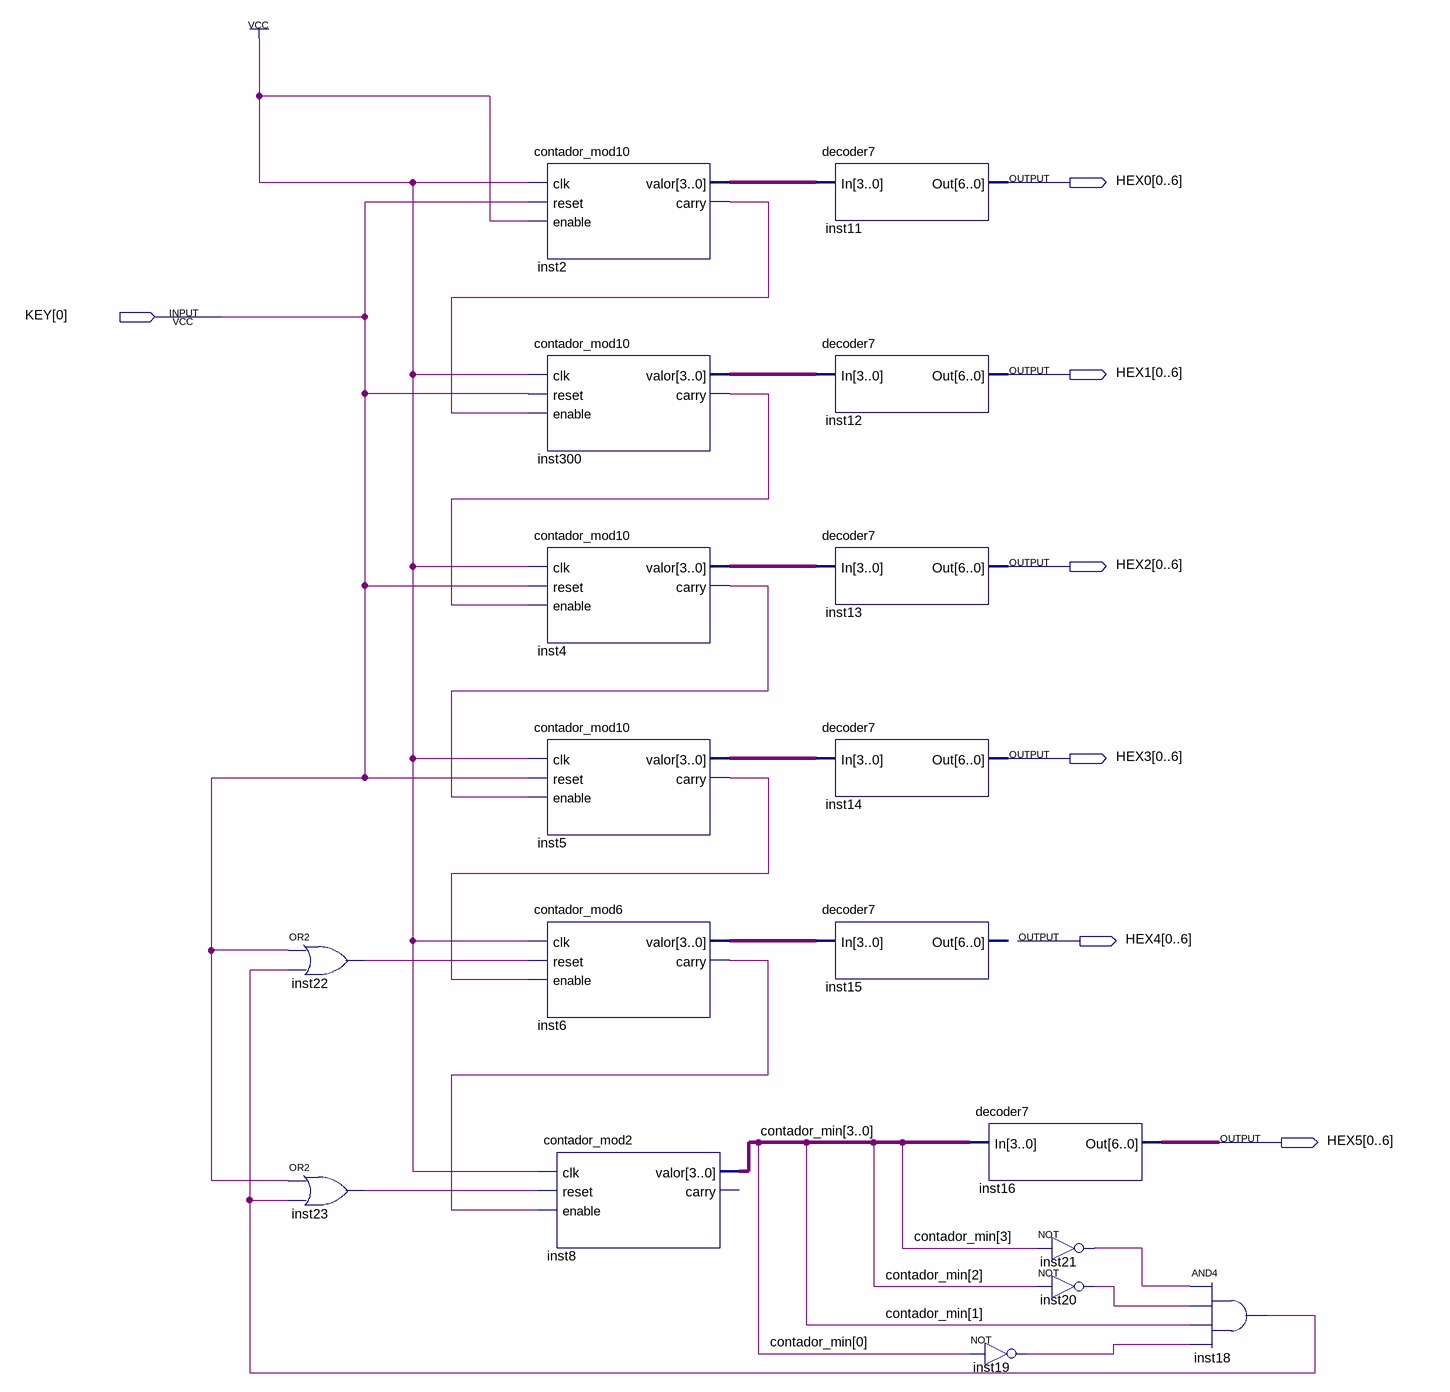
[diagram p0: schematic sheet]
// Quartus schematic cronometro_enable_sim.bdf as structural Verilog: 18 symbols, 7 pins
module cronometro_enable_sim (
  input  [0:0] KEY,
  output [0:6] HEX0,
  output [0:6] HEX1,
  output [0:6] HEX2,
  output [0:6] HEX3,
  output [0:6] HEX4,
  output [0:6] HEX5
);

  wire inst2_carry, inst4_carry, inst5_carry, inst6_carry, inst18_out, inst19_out, inst20_out, inst21_out,
       inst22_out, inst23_out, inst300_carry;
  wire [3:0] contador_min, inst2_valor, inst4_valor, inst5_valor, inst6_valor, inst300_valor;

  or inst22 (inst22_out, KEY[0], inst18_out);
  or inst23 (inst23_out, KEY[0], inst18_out);
  contador_mod10 inst2 (.clk(1'b1), .reset(KEY[0]), .enable(1'b1), .valor(inst2_valor), .carry(inst2_carry));
  contador_mod10 inst300 (
    .clk(1'b1), .reset(KEY[0]), .enable(inst2_carry), .valor(inst300_valor), .carry(inst300_carry));
  contador_mod10 inst4 (.clk(1'b1), .reset(KEY[0]), .enable(inst300_carry), .valor(inst4_valor), .carry(inst4_carry));
  contador_mod10 inst5 (.clk(1'b1), .reset(KEY[0]), .enable(inst4_carry), .valor(inst5_valor), .carry(inst5_carry));
  contador_mod6 inst6 (.clk(1'b1), .reset(inst22_out), .enable(inst5_carry), .valor(inst6_valor), .carry(inst6_carry));
  contador_mod2 inst8 (.clk(1'b1), .reset(inst23_out), .enable(inst6_carry), .valor(contador_min));  // open: carry
  decoder7 inst11 (.In(inst2_valor), .Out(HEX0));
  decoder7 inst12 (.In(inst300_valor), .Out(HEX1));
  decoder7 inst13 (.In(inst4_valor), .Out(HEX2));
  decoder7 inst14 (.In(inst5_valor), .Out(HEX3));
  decoder7 inst15 (.In(inst6_valor));  // open: Out
  decoder7 inst16 (.In(contador_min), .Out(HEX5));
  not inst21 (inst21_out, contador_min[3]);
  not inst20 (inst20_out, contador_min[2]);
  not inst19 (inst19_out, contador_min[0]);
  and inst18 (inst18_out, inst21_out, inst20_out, contador_min[1], inst19_out);
endmodule
